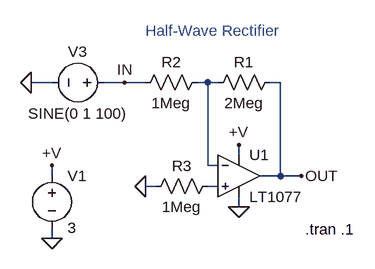
[diagram p0: schematic 1077.asc]
1077.asc, the LTspice schematic file:
Version 4
SHEET 1 896 680
WIRE -96 96 -128 96
WIRE 16 96 -16 96
WIRE 48 96 16 96
WIRE 144 96 128 96
WIRE 160 96 144 96
WIRE 256 96 240 96
WIRE 192 208 192 192
WIRE 144 224 144 96
WIRE 160 224 144 224
WIRE -96 240 -96 224
WIRE 256 240 256 96
WIRE 256 240 224 240
WIRE 288 240 256 240
WIRE 64 256 48 256
WIRE 160 256 144 256
WIRE 192 288 192 272
WIRE -96 336 -96 320
FLAG -96 336 0
FLAG 192 192 +V
FLAG -96 224 +V
FLAG -128 96 0
FLAG 48 256 0
FLAG 192 288 0
FLAG 16 96 IN
FLAG 288 240 OUT
SYMBOL voltage -96 224 R0
SYMATTR InstName V1
SYMATTR Value 3
SYMBOL res 256 80 R90
WINDOW 0 0 56 VBottom 0
WINDOW 3 32 56 VTop 0
SYMATTR InstName R1
SYMATTR Value 2Meg
SYMBOL res 144 80 R90
WINDOW 0 0 56 VBottom 0
WINDOW 3 32 56 VTop 0
SYMATTR InstName R2
SYMATTR Value 1Meg
SYMBOL voltage 0 96 R90
WINDOW 0 -32 56 VBottom 0
WINDOW 3 32 56 VTop 0
SYMATTR InstName V3
SYMATTR Value SINE(0 1 100)
SYMBOL opamps\\LT1077 192 176 R0
SYMATTR InstName U1
SYMBOL res 160 240 R90
WINDOW 0 0 56 VBottom 0
WINDOW 3 32 56 VTop 0
SYMATTR InstName R3
SYMATTR Value 1Meg
TEXT 294 322 Left 0 !.tran .1
TEXT 152 32 Bottom 0 ;Half-Wave Rectifier

The netlist it stands for:
* 1077.asc
V1 +V 0 3
R1 OUT N001 2Meg
R2 N001 IN 1Meg
V3 IN 0 SINE(0 1 100)
XU1 N002 N001 +V 0 OUT LT1077  ; pins In+ In- V+ V- OUT
R3 N002 0 1Meg
.tran .1
* Half-Wave Rectifier
.backanno
.end